# EAGLE design Nixie Clock Main Board V1.1 (EAGLE 9.6.0)
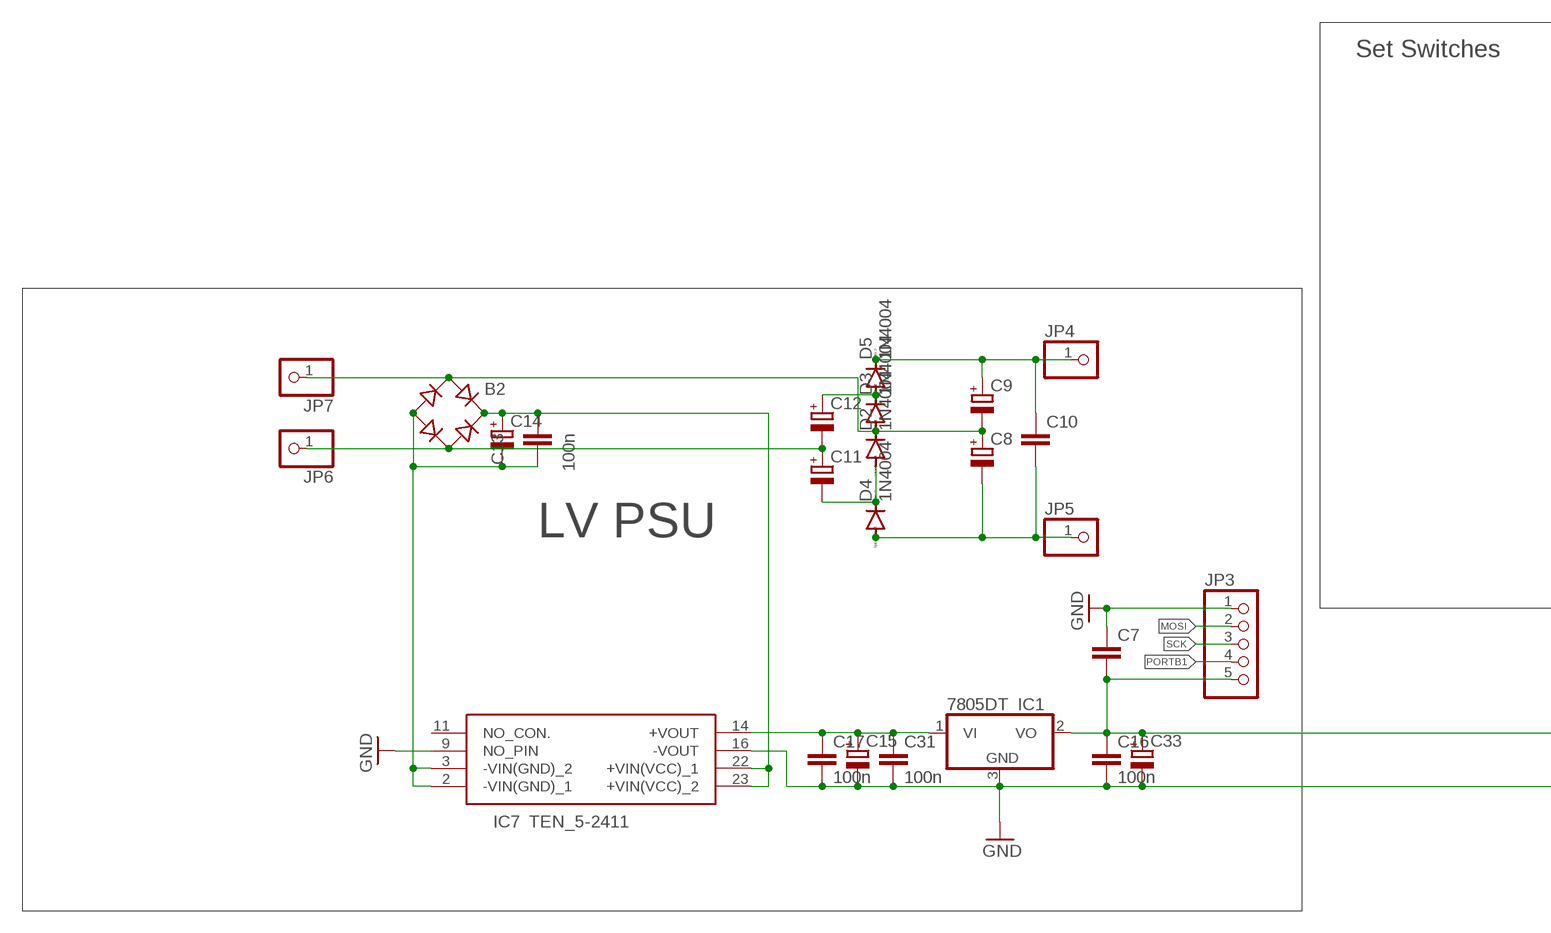
[diagram p0: schematic, sheet 1, part 1 of 2]
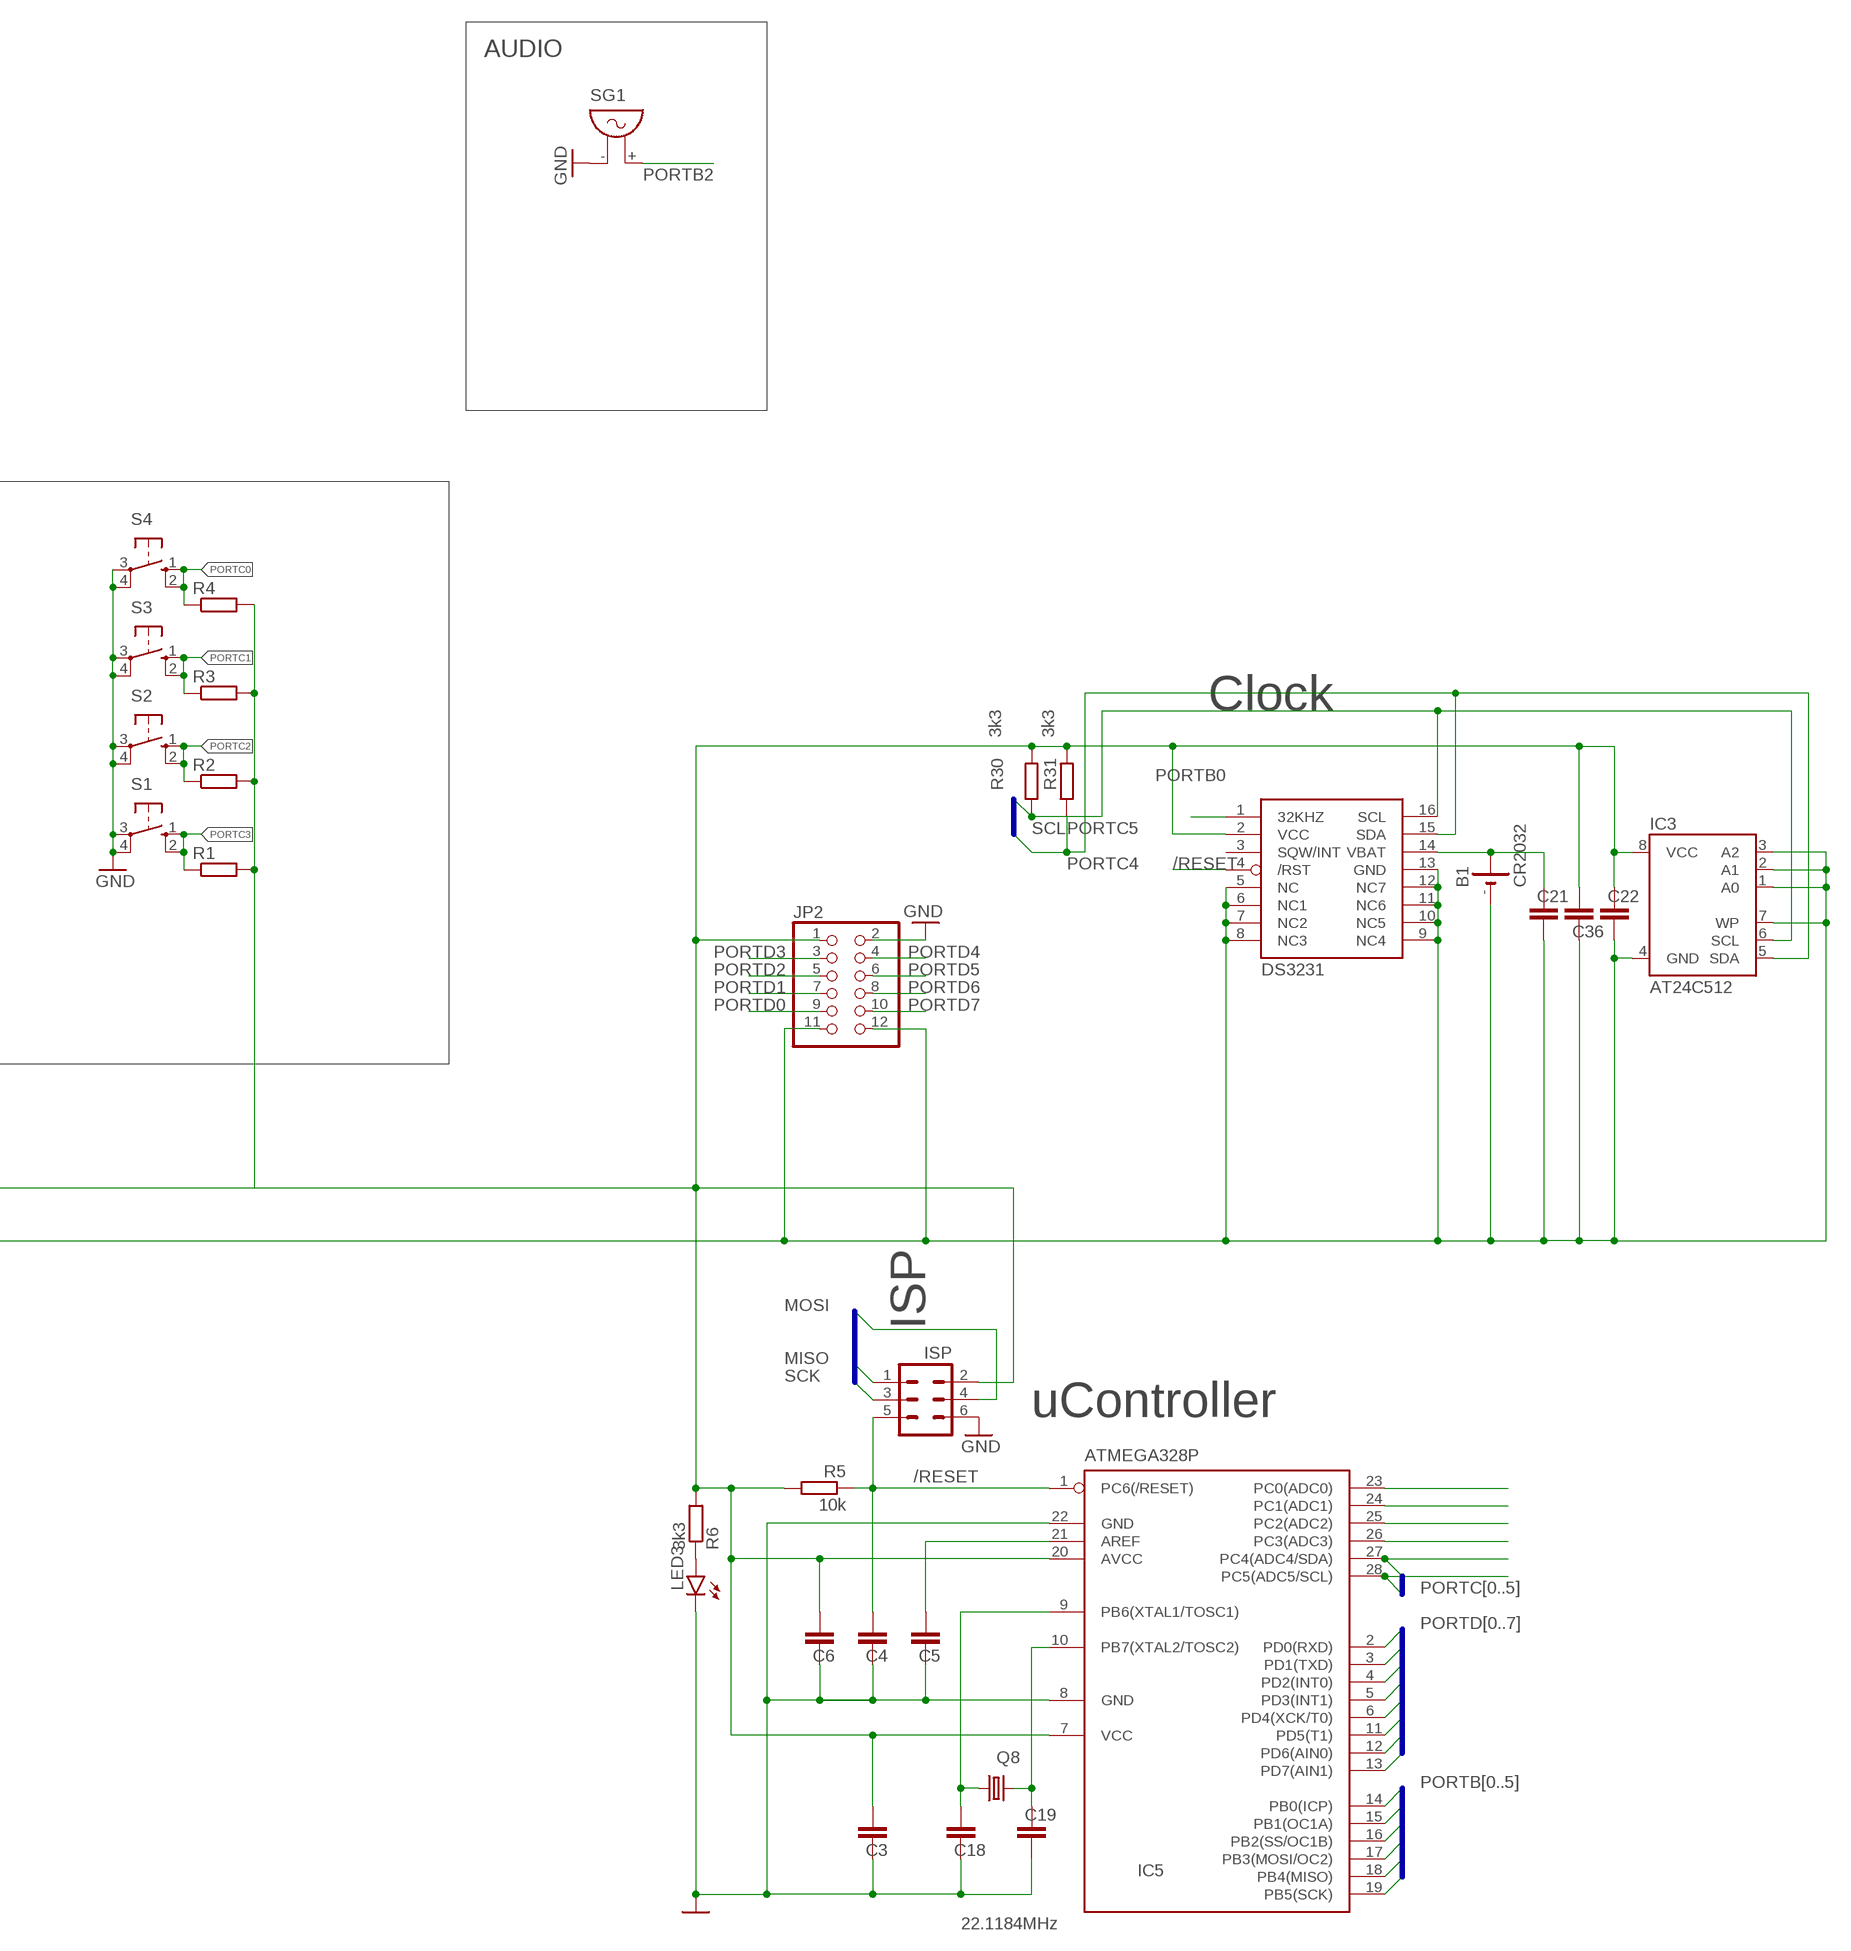
[diagram p1: schematic, sheet 1, part 2 of 2]

## Parts
B1  CR2032  [CR2032]
B2  B-DIL  [B-DIL]
C3  C-EUC1206  [C1206]
C4  C-EUC0805  [C0805]
C5  C-EUC1206  [C1206]
C6  C-EUC1206  [C1206]
C7  C-EUC0805  [C0805]
C8  CPOL-EUTT5D11  [TT5D11]
C9  CPOL-EUTT5D11  [TT5D11]
C10  C-EU150-054X183  [C150-054X183]
C11  CPOL-EUTT5D11  [TT5D11]
C12  CPOL-EUTT5D11  [TT5D11]
C13  100n  C-EU050-025X075  [C050-025X075]
C14  CPOL-EUTT5D11  [TT5D11]
C15  CPOL-EUE3.5-8  [E3,5-8]
C16  100n  C-EUC1206  [C1206]
C17  100n  C-EUC1206  [C1206]
C18  C-EUC0805  [C0805]
C19  C-EUC0805  [C0805]
C21  C-EUC1206  [C1206]
C22  C-EUC1206  [C1206]
C31  100n  C-EUC1206  [C1206]
C33  CPOL-EUE3.5-8  [E3,5-8]
C36  C-EUC1206  [C1206]
D2  1N4004  [DO41-10]
D3  1N4004  [DO41-10]
D4  1N4004  [DO41-10]
D5  1N4004  [DO41-10]
IC1  7805DT  [TO252]
IC3  AT24C512  AT24CP  [DIL08]
IC5  ATMEGA328P  MEGA8-P  [DIL28-3]
IC7  TEN_5-2411  [TEN5SERIES]
J  ISP  MA03-2  [MA03-2]
JP2  PINHD-2X6  [2X06]
JP3  PINHD-1X5  [1X05]
JP4  PINHD-1X1  [1X01]
JP5  PINHD-1X1  [1X01]
JP6  PINHD-1X1  [1X01]
JP7  PINHD-1X1  [1X01]
LED3  LED5MM  [LED5MM]
Q8  22.1184MHz  CRYSTALHC49U-V  [HC49U-V]
R1  R-EU_R0805  [R0805]
R2  R-EU_R0805  [R0805]
R3  R-EU_R0805  [R0805]
R4  R-EU_R0805  [R0805]
R5  10k  R-EU_R0805  [R0805]
R6  3k3  R-EU_R0805  [R0805]
R30  3k3  R-EU_R0805  [R0805]
R31  3k3  R-EU_R0805  [R0805]
S1  10-XX  [B3F-10XX]
S2  10-XX  [B3F-10XX]
S3  10-XX  [B3F-10XX]
S4  10-XX  [B3F-10XX]
SG1  F/QMX  [F/QMX]
U2  DS3231  DS3231/SO  [SO16W]

## Nets
+5V: C3.1 C6.1 C7.2 C16.1 C22.1 C33.+ C36.1 IC1.2(VO) IC3.8(VCC) IC5.7(VCC) IC5.20(AVCC) J.2 JP2.1 JP3.5 R1.2 R2.2 R3.2 R4.2 R5.2 R6.2 R30.2 R31.2 U2.2(VCC)
/RESET: C4.1 IC5.1(PC6(/RESET)) J.5 R5.1 U2.4(/RST)
GND: B1.- C3.2 C4.2 C5.2 C6.2 C7.1 C15.- C16.2 C17.2 C18.2 C19.2 C21.2 C22.2 C31.2 C33.- C36.2 IC1.3(GND) IC3.1(A0) IC3.2(A1) IC3.3(A2) IC3.4(GND) IC3.7(WP) IC5.8(GND) IC5.22(GND) IC7.9(NO_PIN) IC7.16(-VOUT) J.6 JP2.2 JP2.11 JP2.12 JP3.1 LED3.K(C) S1.3(P) S1.4(P1) S2.3(P) S2.4(P1) S3.3(P) S3.4(P1) S4.3(P) S4.4(P1) SG1.- U2.5(NC) U2.6(NC1) U2.7(NC2) U2.8(NC3) U2.9(NC4) U2.10(NC5) U2.11(NC6) U2.12(NC7) U2.13(GND)
MISO: IC5.18(PB4(MISO)) J.1
MOSI: IC5.17(PB3(MOSI/OC2)) J.4 JP3.2
N$3: C12.+ D3.C D5.A
N$4: B2.AC1 C8.+ C9.- D2.C D3.A JP7.1
N$5: C11.- D2.A D4.C
N$7: B2.AC2 C11.+ C12.- JP6.1
N$8: B2.+ C13.2 C14.+ IC7.22(+VIN(VCC)_1) IC7.23(+VIN(VCC)_2)
N$10: C8.- C10.2 D4.A JP5.1
N$12: C9.+ C10.1 D5.C JP4.1
N$17: LED3.A R6.1
N$37: B2.- C13.1 C14.- IC7.2(-VIN(GND)_1) IC7.3(-VIN(GND)_2)
N$38: C18.1 IC5.9(PB6(XTAL1/TOSC1)) Q8.1
N$39: C19.1 IC5.10(PB7(XTAL2/TOSC2)) Q8.2
N$40: B1.+ C21.1 U2.14(VBAT)
N$46: C5.1 IC5.21(AREF)
N$53: C15.+ C17.1 C31.1 IC1.1(VI) IC7.14(+VOUT)
PORTB0: IC5.14(PB0(ICP)) U2.1(32KHZ)
PORTB1: IC5.15(PB1(OC1A)) JP3.4
PORTB2: IC5.16(PB2(SS/OC1B)) SG1.+
PORTC0: IC5.23(PC0(ADC0)) R4.1 S4.1(S) S4.2(S1)
PORTC1: IC5.24(PC1(ADC1)) R3.1 S3.1(S) S3.2(S1)
PORTC2: IC5.25(PC2(ADC2)) R2.1 S2.1(S) S2.2(S1)
PORTC3: IC5.26(PC3(ADC3)) R1.1 S1.1(S) S1.2(S1)
PORTC4: IC3.5(SDA) IC5.27(PC4(ADC4/SDA)) R31.1 U2.15(SDA)
PORTC5: IC3.6(SCL) IC5.28(PC5(ADC5/SCL)) R30.1 U2.16(SCL)
PORTD0: IC5.2(PD0(RXD)) JP2.9
PORTD1: IC5.3(PD1(TXD)) JP2.7
PORTD2: IC5.4(PD2(INT0)) JP2.5
PORTD3: IC5.5(PD3(INT1)) JP2.3
PORTD4: IC5.6(PD4(XCK/T0)) JP2.4
PORTD5: IC5.11(PD5(T1)) JP2.6
PORTD6: IC5.12(PD6(AIN0)) JP2.8
PORTD7: IC5.13(PD7(AIN1)) JP2.10
SCK: IC5.19(PB5(SCK)) J.3 JP3.3
Unconnected: IC7.11(NO_CON.) U2.3(SQW/INT)

## Buses
PORTC[0..5]
PORTD[0..7]
PORTB[0..5]

## Notes on the sheet
- AUDIO
- Set Switches
- Clock
- SCL
- LV PSU
- ISP
- uController

## Library data of the parts
B1 = GSM:CR2032: LI BATTERY Varta
B2 = rectifier:B-DIL: RECTIFIER
C3-C7 C10 C16-C19 C21 C22 C31 C36 = rcl:C-EU: CAPACITOR, European symbol; SPICEPREFIX: C
C8 C9 C11 C12 C14 C15 C33 = rcl:CPOL-EU: POLARIZED CAPACITOR, European symbol; SPICEPREFIX: C
C13 = rcl:C-EU: CAPACITOR, European symbol
D2-D5 = diode:1N4004: DIODE general purpose rectifier, 1 A
IC1 = linear:78*: Positive VOLTAGE REGULATOR Source: http://cache.national.com/ds/LM/LM78L05.pdf http://www.fairchildsemi.com/ds/LM/LM7805.pdf
IC3 = atmel:AT24C*: 2-wire serial EEPROM; MPN: AT24C1024BW-SH-B; OC_FARNELL: 1362646; OC_NEWARK: 03P2044
IC5 = atmel:MEGA8-P: MICROCONTROLLER 8 Kbytes FLASH, 1 kbytes SRAM, 512 bytes EEPROM, USART, 4-channel 10 bit ADC, 2-channel 8 bit ADC Pin compatible with Atmega48, ATMega88, ATMega168 Source: avr.lbr; OC_FARNELL: unknown; OC_NEWARK: unknown
IC7 = TEN_5-2411:TEN_5-2411: Isolated DC/DC Converters Source: Datasheet <http://docs-emea.rs-online.com/webdocs/13fb/0900766b813fbc80.pdf>; DESCRIPTION: Isolated DC/DC Converters; HEIGHT: mm; MANUFACTURER_NAME: Traco Power; MANUFACTURER_PART_NUMBER: TEN 5-2411; MOUSER_PART_NUMBER: 495-TEN-5-2411; MOUSER_PRICE-STOCK: https://www.mouser.com/Search/Refine.aspx?Keyword=495-TEN-5-2411; RS_PART_NUMBER: 2932757P; RS_PRICE-STOCK: http://uk.rs-online.com/web/p/products/2932757P
J = con-lstb:MA03-2: PIN HEADER; OC_FARNELL: unknown; OC_NEWARK: unknown
JP2 = pinhead:PINHD-2X6: PIN HEADER
JP3 = pinhead:PINHD-1X5: PIN HEADER
JP4-JP7 = pinhead:PINHD-1X1: PIN HEADER
LED3 = led:LED: LED OSRAM: - CHIPLED LG R971, LG N971, LY N971, LG Q971, LY Q971, LO R971, LY R971 LH N974, LH R974 LS Q976, LO Q976, LY Q976 LO Q996 - Hyper CHIPLED LW Q18S LB Q993, LB Q99A, LB R99A - SideLED LS A670, LO A670, LY A670, LG A670, LP A670 LB A673, LV A673, LT A673, LW A673 LH A674 LY A675 LS A676, LA A676, LO A676, LY A676, LW A676 LS A679, LY A679, LG A679 - Hyper Micro SIDELED® LS Y876, LA Y876, LO Y876, LY Y876 LT Y87S - SmartLED LW L88C, LW L88S LB L89C, LB L89S, LG L890 LS L89K, LO L89K, LY L89K LS L896, LA L896, LO L896, LY L896 - TOPLED LS T670, LO T670, LY T670, LG T670, LP T670 LSG T670, LSP T670, LSY T670, LOP T670, LYG T670 LG T671, LOG T671, LSG T671 LB T673, LV T673, LT T673, LW T673 LH T674 LS T676, LA T676, LO T676, LY T676, LB T676, LH T676, LSB T676, LW T676 LB T67C, LV T67C, LT T67C, LS T67K, LO T67K, LY T67K, LW E67C LS E67B, LA E67B, LO E67B, LY E67B, LB E67C, LV E67C, LT E67C LW T67C LS T679, LY T679, LG T679 LS T770, LO T770, LY T770, LG T770, LP T770 LB T773, LV T773, LT T773, LW T773 LH T774 LS E675, LA E675, LY E675, LS T675 LS T776, LA T776, LO T776, LY T776, LB T776 LHGB T686 LT T68C, LB T68C - Hyper Mini TOPLED® LB M676 - Mini TOPLED Santana® LG M470 LS M47K, LO M47K, LY M47K Source: http://www.osram.convergy.de LUXEON: - LUMILED® LXK2-PW12-R00, LXK2-PW12-S00, LXK2-PW14-U00, LXK2-PW14-V00 LXK2-PM12-R00, LXK2-PM12-S00, LXK2-PM14-U00 LXK2-PE12-Q00, LXK2-PE12-R00, LXK2-PE12-S00, LXK2-PE14-T00, LXK2-PE14-U00 LXK2-PB12-K00, LXK2-PB12-L00, LXK2-PB12-M00, LXK2-PB14-N00, LXK2-PB14-P00, LXK2-PB14-Q00 LXK2-PR12-L00, LXK2-PR12-M00, LXK2-PR14-Q00, LXK2-PR14-R00 LXK2-PD12-Q00, LXK2-PD12-R00, LXK2-PD12-S00 LXK2-PH12-R00, LXK2-PH12-S00 LXK2-PL12-P00, LXK2-PL12-Q00, LXK2-PL12-R00 Source: www.luxeon.com KINGBRIGHT: KA-3528ASYC Source: www.kingbright.com
Q8 = crystal:CRYSTAL: CRYSTAL; OC_FARNELL: 1666969; OC_NEWARK: unknown
R1-R6 R30 R31 = rcl:R-EU_: RESISTOR, European symbol; SPICEPREFIX: R
S1-S4 = switch-omron:10-XX: OMRON SWITCH; MPN: B3F-1000; OC_FARNELL: 176432; OC_NEWARK: 36M3542
SG1 = buzzer:F/QMX: BUZZER Source: Buerklin; OC_FARNELL: unknown; OC_NEWARK: unknown
U2 = adafruit:DS3231

## Board
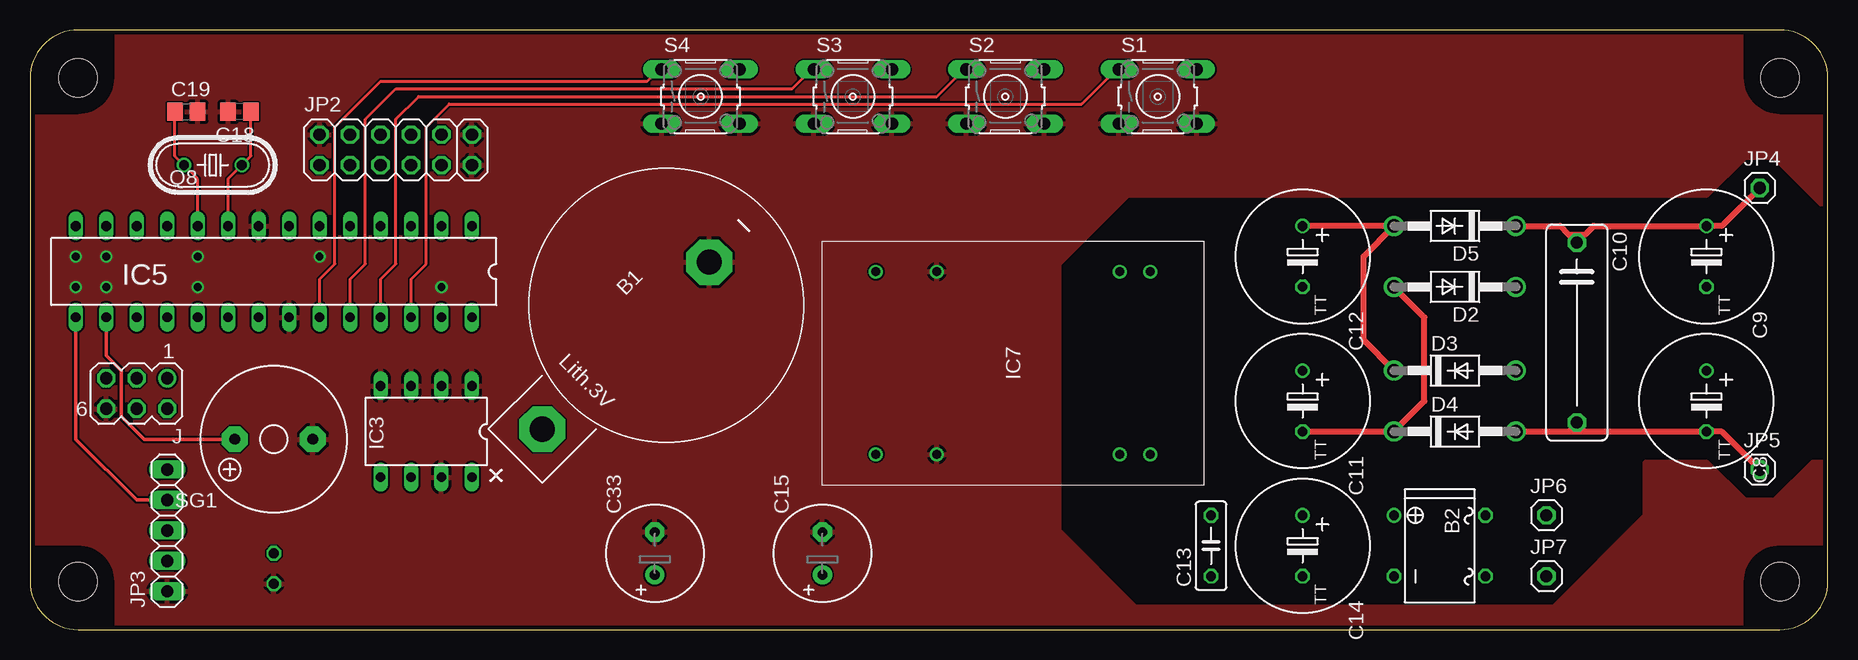
[diagram p2: board, top side]
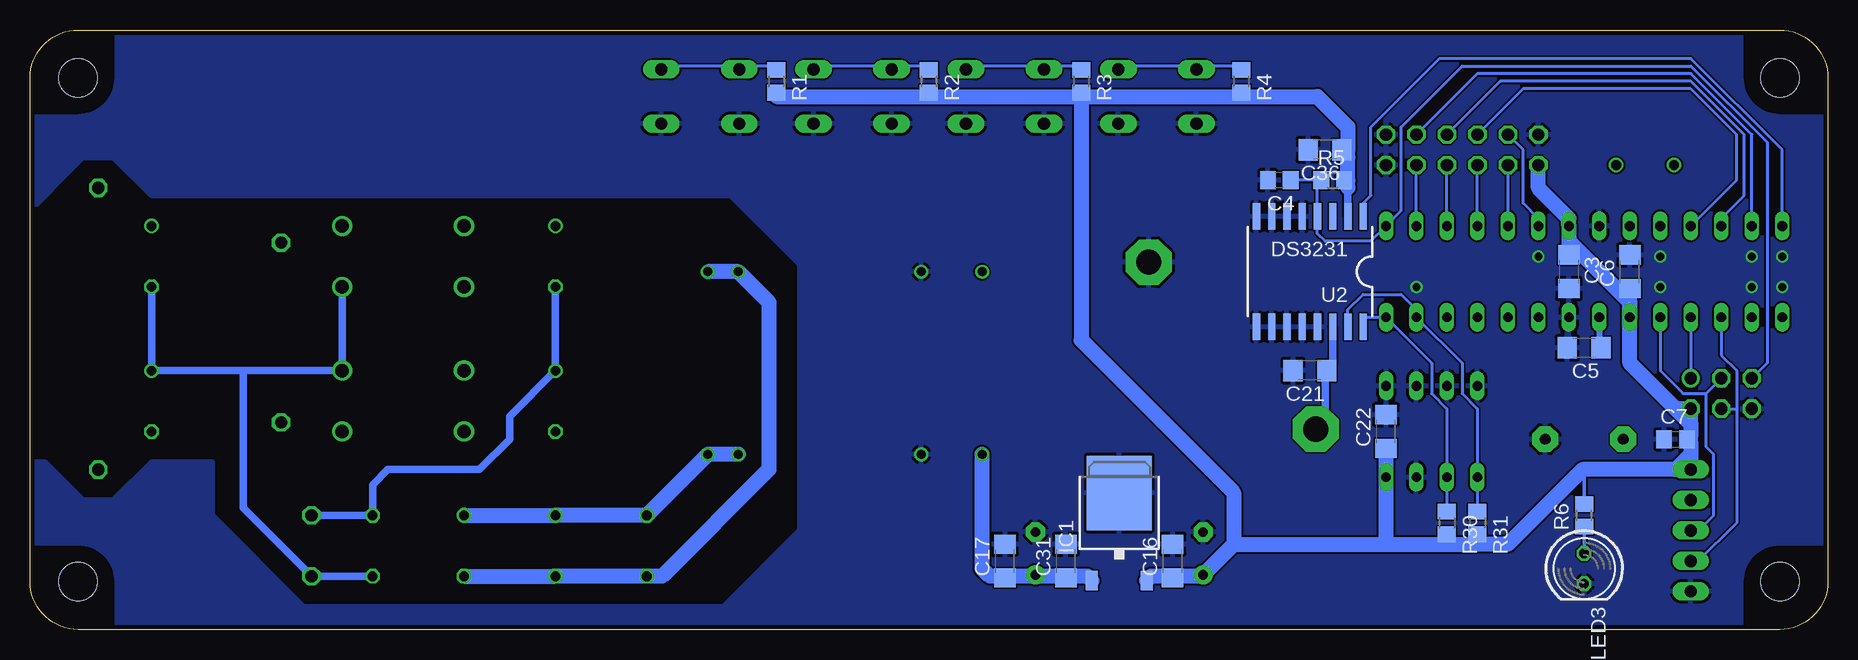
[diagram p3: board, bottom side, seen from below]

Size 149.83 x 50 mm. Coordinates in mm from the lower left corner, seen from the top.
Copper layers (1*16): Top 0.0356mm / dielectric 1.5011mm / Bottom 0.0356mm
Design rules "LaenPCBOrder": minimum track width 6mil, minimum drill 13mil, track to track 6mil, track to pad 6mil, pad to pad 6mil, via to via 6mil, smd to smd 6mil, copper to edge 15mil, drill to drill 6mil, minimum pad ring 7mil, minimum via ring 7mil, stop-mask expansion 3mil, vias tented up to drill 0mil, thermal gap 10mil

### Footprints (pad centres in the part's own frame; a part is rotated, then mirrored left to right if it is on the bottom)
CR2032 = drill 2.1 pad 3.81 octagon: + -4.445,11.43; - -4.445,-8.255
B-DIL = drill 0.813: + -2.54,-3.81 | drill 0.813 octagon: - 2.54,-3.81; AC1 2.54,3.81; AC2 -2.54,3.81
C1206 = smd 1.6 x 1.8: 1 -1.4,0; 2 1.4,0
C0805 = smd 1.3 x 1.5: 1 -0.95,0; 2 0.95,0
TT5D11 = drill 0.813: + -2.54,0 | drill 0.813 octagon: - 2.54,0
C150-054X183 = drill 1.016 octagon: 1 -7.493,0; 2 7.493,0
C050-025X075 = drill 0.813 octagon: 1 -2.54,0; 2 2.54,0
E3,5-8 = drill 0.813 pad 1.6: + -1.778,0 | drill 0.813 pad 1.6 octagon: - 1.778,0
DO41-10 = drill 1.118: A 5.08,0; C -5.08,0
TO252 = smd 1 x 1.6: 1 -2.28,-4.8; 2 2.28,-4.8 | smd 5.4 x 6.2: 3 0,2.5
DIL08 = drill 0.813 long: 1 -3.81,-3.81; 2 -1.27,-3.81; 3 1.27,-3.81; 4 3.81,-3.81; 5 3.81,3.81; 6 1.27,3.81; 7 -1.27,3.81; 8 -3.81,3.81
DIL28-3 = drill 0.813 long: 1 -16.51,-3.81; 2 -13.97,-3.81; 3 -11.43,-3.81; 4 -8.89,-3.81; 5 -6.35,-3.81; 6 -3.81,-3.81; 7 -1.27,-3.81; 8 1.27,-3.81; 9 3.81,-3.81; 10 6.35,-3.81; 11 8.89,-3.81; 12 11.43,-3.81; 13 13.97,-3.81; 14 16.51,-3.81; 15 16.51,3.81; 16 13.97,3.81; 17 11.43,3.81; 18 8.89,3.81; 19 6.35,3.81; 20 3.81,3.81; 21 1.27,3.81; 22 -1.27,3.81; 23 -3.81,3.81; 24 -6.35,3.81; 25 -8.89,3.81; 26 -11.43,3.81; 27 -13.97,3.81; 28 -16.51,3.81
TEN5SERIES = drill 0.75 pad 1.15: 2 -7.61,11.43; 3 -7.61,8.89; 9 -7.61,-6.35; 11 -7.61,-11.43; 14 7.61,-11.43; 16 7.61,-6.35; 22 7.61,8.89; 23 7.61,11.43
MA03-2 = drill 1.016: 1 -2.54,-1.27 | drill 1.016 octagon: 2 -2.54,1.27; 3 0,-1.27; 4 0,1.27; 5 2.54,-1.27; 6 2.54,1.27
2X06 = drill 1.016 octagon: 1 -6.35,-1.27; 2 -6.35,1.27; 3 -3.81,-1.27; 4 -3.81,1.27; 5 -1.27,-1.27; 6 -1.27,1.27; 7 1.27,-1.27; 8 1.27,1.27; 9 3.81,-1.27; 10 3.81,1.27; 11 6.35,-1.27; 12 6.35,1.27
1X05 = drill 1.016 long: 1 -5.08,0; 2 -2.54,0; 3 0,0; 4 2.54,0; 5 5.08,0
1X01 = drill 1.016 octagon: 1 0,0
LED5MM = drill 0.813 octagon: A -1.27,0; K 1.27,0
HC49U-V = drill 0.813: 1 -2.413,0; 2 2.413,0
R0805 = smd 1.3 x 1.5: 1 -0.95,0; 2 0.95,0
B3F-10XX = drill 1.016 long: 1 -3.251,2.261; 2 3.251,2.261; 3 -3.251,-2.261; 4 3.251,-2.261
F/QMX = drill 0.914 pad 2.159 octagon: + 3.251,0; - -3.251,0
SO16W = smd 0.6 x 2.2: 1 -4.445,-4.6; 2 -3.175,-4.6; 3 -1.905,-4.6; 4 -0.635,-4.6; 5 0.635,-4.6; 6 1.905,-4.6; 7 3.175,-4.6; 8 4.445,-4.6; 9 4.445,4.6; 10 3.175,4.6; 11 1.905,4.6; 12 0.635,4.6; 13 -0.635,4.6; 14 -1.905,4.6; 15 -3.175,4.6; 16 -4.445,4.6
50X150 = hole 3.2: 4,4; 145.83,4; 145.83,46; 4,46

### Placement (x,y rotation side)
B1  47.62,27.94 135 top
B2  117.47,6.99 270 top
C3  21.59,29.84 270 bottom
C4  45.72,37.47 180 bottom
C5  20.32,23.5 180 bottom
C6  16.51,29.84 90 bottom
C7  12.7,15.88 0 bottom
C8  139.7,19.05 270 top
C9  139.7,31.11 270 top
C10  128.91,24.77 270 top
C11  106.05,19.05 270 top
C12  106.05,31.11 270 top
C13  98.42,6.99 90 top
C14  106.05,6.99 270 top
C15  66.04,6.35 90 top
C16  54.61,5.71 90 bottom
C17  68.58,5.71 90 bottom
C18  17.46,43.18 180 top
C19  13.02,43.18 0 top
C21  43.18,21.59 180 bottom
C22  36.83,16.51 90 bottom
C31  63.5,5.71 90 bottom
C33  52.07,6.35 90 top
C36  41.91,40.01 180 bottom
D2  118.75,28.57 180 top
D3  118.75,21.59 0 top
D4  118.75,16.51 0 top
D5  118.75,33.66 180 top
IC1  59.05,8.89 0 bottom
IC3  33.02,16.51 180 top
IC5  20.32,29.84 180 top
IC7  81.92,22.23 270 top
J  8.89,19.68 180 top
JP2  30.48,40.01 0 top
JP3  11.43,8.26 90 top
JP4  144.15,36.83 0 top
JP5  144.15,13.34 0 top
JP6  126.36,9.53 0 top
JP7  126.36,4.45 0 top
LED3  20.32,5.08 270 bottom
Q8  15.24,38.73 180 top
R1  87.63,45.72 270 bottom
R2  74.93,45.72 270 bottom
R3  62.23,45.72 270 bottom
R4  48.9,45.72 270 bottom
R5  41.27,37.47 0 bottom
R6  20.32,9.53 90 bottom
R30  31.75,8.89 270 bottom
R31  29.21,8.89 270 bottom
S1  93.98,44.45 0 top
S2  81.28,44.45 0 top
S3  68.58,44.45 0 top
S4  55.88,44.45 0 top
SG1  20.32,15.88 180 top
U2  43.18,29.84 180 bottom
U$3  [50X150]  0,0 0 top

### Tracks (layer width: path | path; a pad name or v marks a point on that pad's centre or on a via)
+5V
  Bottom 0.152: R5.2 40.01,37.47
  Bottom 0.254: R4.2 48.9,44.45 | R3.2 62.23,44.45 | R2.2 74.93,44.45 | C36.1 40.01,40.01 | R1.2 87.63,44.45
  Bottom 0.305: R6.2 20.32,13.21 20.45,13.34
  Bottom 0.61: U2.2 40.01,36.83
  Bottom 0.813: C33.+ 52.2,4.45 | 54.48,4.45 C16.1
  Bottom 1.27: C22.1 IC3.8 36.83,7.11 | IC5.7 C3.1 | IC5.7 21.59,32.38 16.51,27.3 IC5.20 | IC5.20 C6.1 | 52.2,4.45 54.48,4.45 | C16.1 54.74,4.45 56.42,4.45 IC1.2 | 11.43,16.2 C7.2 11.43,15.55 | 11.43,17.14 11.43,16.2 | 11.43,15.55 11.43,16.2 | 11.43,17.14 J.2 12.7,18.41 | 12.7,13.34 JP3.5 11.43,14.61 | 12.7,13.34 20.45,13.34 26.67,7.11 29.21,7.11 | IC5.7 21.59,34.29 24.13,36.83 JP2.1 | 49.53,7.11 49.53,11.43 62.23,24.13 R3.2 | 49.53,7.11 C33.+ | 49.53,7.11 36.83,7.11 | 36.83,7.11 31.75,7.11 | 31.75,7.11 R30.2 | 31.75,7.11 29.21,7.11 | 29.21,7.11 R31.2 | 87.63,44.45 74.93,44.45 62.23,44.45 48.9,44.45 42.55,44.45 40.01,41.91 40.01,40.01 40.01,39.37 40.01,37.47 40.01,36.83 | 12.7,18.41 16.51,22.23 IC5.20 | 12.7,18.41 11.43,17.14 | 11.43,15.55 11.43,14.61 | 11.43,14.61 12.7,13.34
/RESET
  Bottom 0.254: J.5 5.08,22.23 5.08,40.64 11.43,46.99 30.48,46.99 35.56,41.91 35.56,34.92 IC5.1 38.1,32.38 41.91,32.38 42.55,33.02 U2.4 42.55,37.47 | 42.55,37.15 R5.1 42.55,37.47 | 42.55,37.47 45.09,37.47
  Bottom 0.305: 45.09,37.47 C4.1
GND  (via drill 0.65)
  other vias: 13.97,31.11 3.81,28.57 3.81,31.11 13.97,28.57 34.29,28.57 24.13,31.11 6.35,31.11 6.35,28.57
  pour Bottom: -0.64,51.44 150.5,51.44 150.5,34.29 145.41,39.37 142.88,39.37 139.7,36.2 91.44,36.2 85.72,30.48 85.72,8.26 92.08,1.91 127,1.91 134.62,9.53 134.62,13.97 139.7,13.97 142.88,10.79 145.41,10.79 148.59,13.97 150.5,13.97 150.5,-0.64 -0.64,-0.64
  pour Top: -1.27,51.44 150.5,51.44 150.5,34.29 145.41,39.37 142.88,39.37 139.7,36.2 91.44,36.2 85.72,30.48 85.72,8.26 92.08,1.91 127,1.91 134.62,9.53 134.62,13.97 139.7,13.97 142.88,10.79 145.41,10.79 148.59,13.97 150.5,13.97 150.5,-0.64 -1.27,-0.64
MISO
  Bottom 0.254: IC5.18 J.1
MOSI
  Bottom 0.254: IC5.17 8.89,22.86 7.62,21.59 7.62,18.41 | 7.62,18.41 7.62,8.89 10.79,5.71 JP3.2 | J.4 7.62,18.41
N$3
  Top 0.508: C12.+ D5.A 111.12,31.11 111.12,24.13 D3.C
N$4
  Bottom 0.61: B2.AC1 JP7.1 132.08,10.16 132.08,21.59 | D2.C D3.A 132.08,21.59 | C9.- C8.+ 132.08,21.59
N$5
  Top 0.508: C11.- 111.76,16.51 | 111.76,16.51 D4.C 116.2,19.05 116.2,26.04 D2.A | 111.76,16.51
N$7
  Bottom 0.61: JP6.1 B2.AC2 121.28,12.06 120.02,13.34 112.39,13.34 109.86,15.88 109.86,17.78 C11.+ C12.-
N$8
  Bottom 1.27: B2.+ C14.+ C13.2 IC7.23 IC7.22
N$10
  Top 0.508: JP5.1 140.97,16.51 C8.- 129.54,16.51 | D4.A 128.27,16.51 | 128.27,16.51 128.91,17.14 | C10.2 128.91,17.14 | 128.91,17.14 129.54,16.51 | 128.27,16.51 129.54,16.51
N$12
  Top 0.508: JP4.1 140.97,33.66 C9.+ 130.3,33.66 129.6,32.96 | D5.C 127.51,33.66 128.21,32.96 | 128.21,32.96 C10.1 129.6,32.96 | 128.21,32.96 129.6,32.96
N$17
  Bottom 0.305: LED3.A R6.1
N$37
  Bottom 1.27: B2.- C14.- C13.1 97.16,4.45 88.27,13.34 88.27,27.3 IC7.3 IC7.2
N$38
  Top 0.254: IC5.9 16.51,37.59 Q8.1 18.41,39.5 C18.1
N$39
  Top 0.254: IC5.10 13.97,37.59 Q8.2 12.07,39.49 C19.1
N$40
  Bottom 0.61: U2.14 41.27,22.09 C21.1 41.91,21.46 41.91,17.14 42.34,16.71 B1.+
N$46
  Bottom 0.508: IC5.21 19.05,23.62 C5.1
N$53
  Bottom 1.27: IC1.1 61.69,4.45 63.37,4.45 C31.1 63.63,4.45 65.91,4.45 C15.+ 66.17,4.45 68.45,4.45 C17.1 68.71,4.45 69.85,4.45 70.48,5.08 IC7.14
PORTB0
  Bottom 0.254: IC5.14 3.81,40.01 11.43,47.62 32.38,47.62 38.1,41.91 38.1,36.2 38.73,35.56 U2.1
PORTB1
  Top 0.305: JP3.4 8.89,10.79 3.81,15.88 IC5.15
PORTB2
  Top 0.305: IC5.16 6.35,22.86 7.62,21.59 7.62,17.78 9.53,15.88 SG1.+
PORTC0
  Top 0.254: IC5.23 24.13,29.21 25.4,30.48 25.4,41.91 29.21,45.72 51.44,45.72 52.43,46.71 S4.1
  Bottom 0.254: R4.1 49.21,46.67 49.53,46.99 52.35,46.99 S4.1 52.91,46.99 58.85,46.99 S4.2
PORTC1
  Top 0.254: IC5.24 26.67,29.21 27.94,30.48 27.94,42.55 30.48,45.09 63.5,45.09 65.13,46.71 S3.1
  Bottom 0.254: R3.1 62.55,46.99 65.05,46.99 S3.1 65.61,46.99 71.55,46.99 S3.2
PORTC2
  Top 0.254: IC5.25 29.21,29.21 30.48,30.48 30.48,42.55 32.38,44.45 75.56,44.45 77.47,46.35 77.67,46.35 S2.1
  Bottom 0.254: R2.1 75.25,46.99 77.75,46.99 S2.1 78.31,46.99 84.25,46.99 S2.2
PORTC3
  Top 0.254: IC5.26 31.75,29.21 33.02,30.48 33.02,41.91 34.92,43.81 87.63,43.81 90.17,46.35 90.37,46.35 S1.1
  Bottom 0.254: R1.1 87.95,46.99 90.45,46.99 S1.1 91.01,46.99 96.95,46.99 S1.2
PORTC4
  Bottom 0.254: R31.1 IC3.5 29.21,18.41 30.48,19.68 30.48,22.23 IC5.27 34.29,26.67 35.56,27.94 38.73,27.94 40.01,26.67 U2.15
PORTC5
  Bottom 0.254: R30.1 IC3.6 31.75,18.41 33.02,19.68 33.02,22.23 IC5.28 38.73,26.04 U2.16
PORTD0
  Bottom 0.254: IC5.2 JP2.9
PORTD1
  Bottom 0.254: IC5.3 JP2.7
PORTD2
  Bottom 0.254: IC5.4 JP2.5
PORTD3
  Bottom 0.254: JP2.3 26.67,34.92 IC5.5
PORTD4
  Bottom 0.254: IC5.6 24.13,34.29 25.4,35.56 25.4,40.01 JP2.4
PORTD5
  Bottom 0.254: IC5.11 7.62,37.47 7.62,41.27 11.43,45.09 25.4,45.09 JP2.6
PORTD6
  Bottom 0.254: IC5.12 8.89,34.29 6.99,36.2 6.99,41.27 11.43,45.72 27.3,45.72 JP2.8
PORTD7
  Bottom 0.254: IC5.13 6.35,41.27 11.43,46.35 29.21,46.35 JP2.10
SCK
  Bottom 0.254: IC5.19 13.97,21.59 12.06,19.68 10.16,19.68 | JP3.3 10.79,8.26 9.53,9.53 9.53,14.61 10.16,15.24 10.16,19.68 | J.3 10.16,19.68